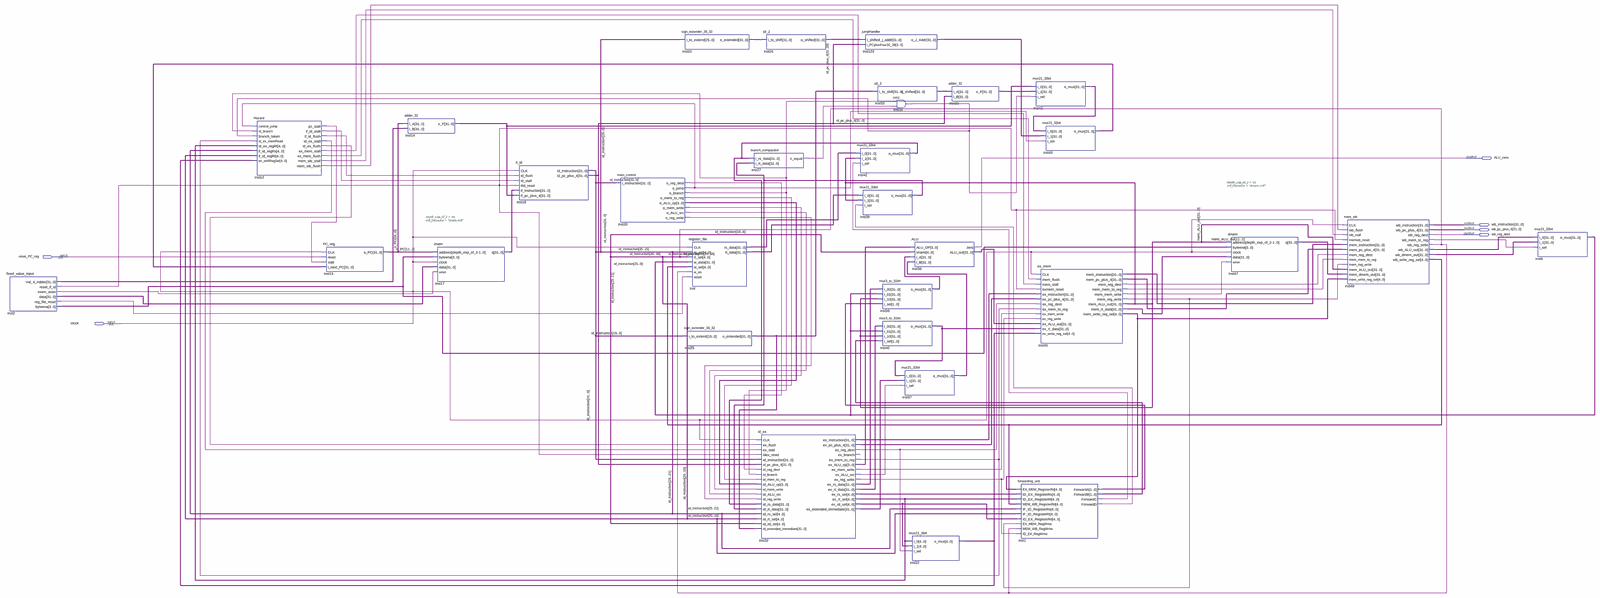
[diagram p0: schematic sheet, whole]
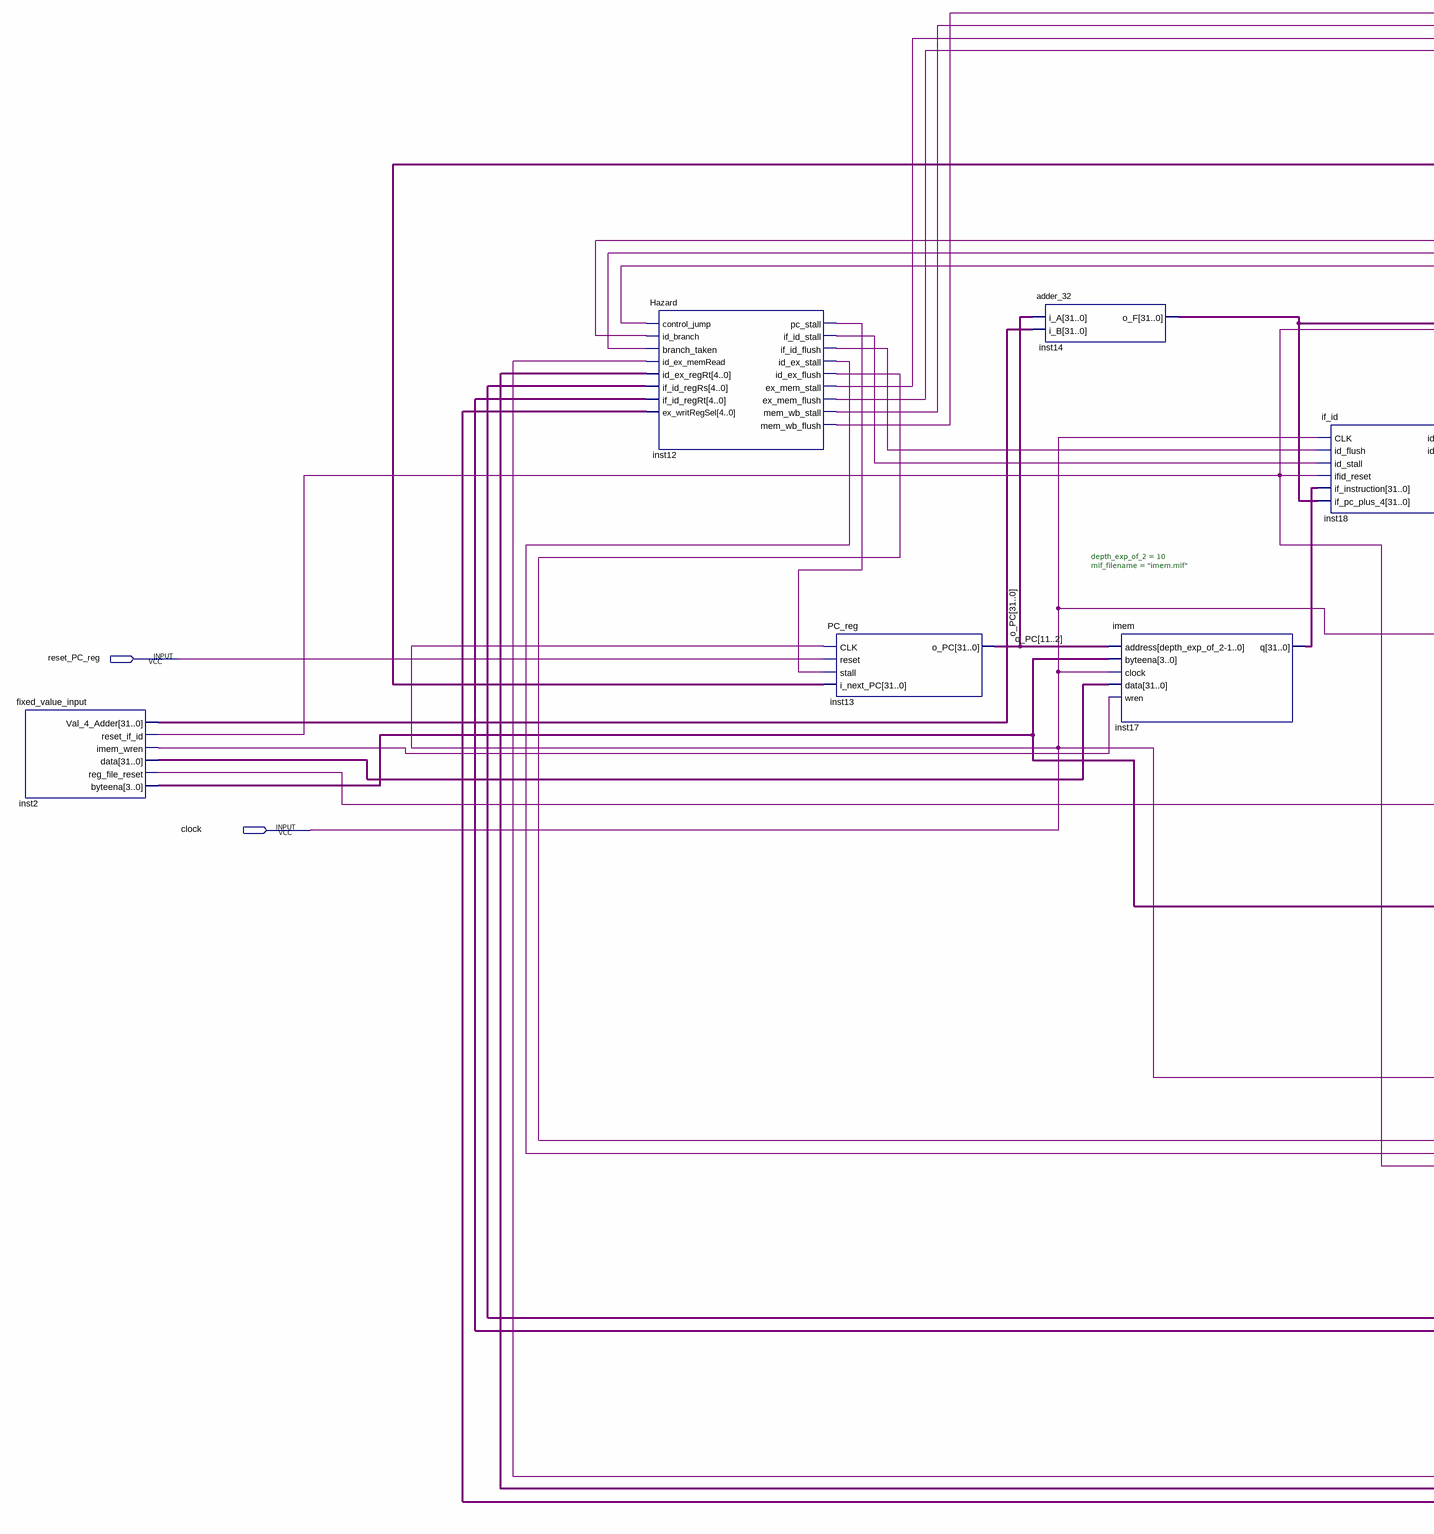
[diagram p1: schematic sheet, left part]
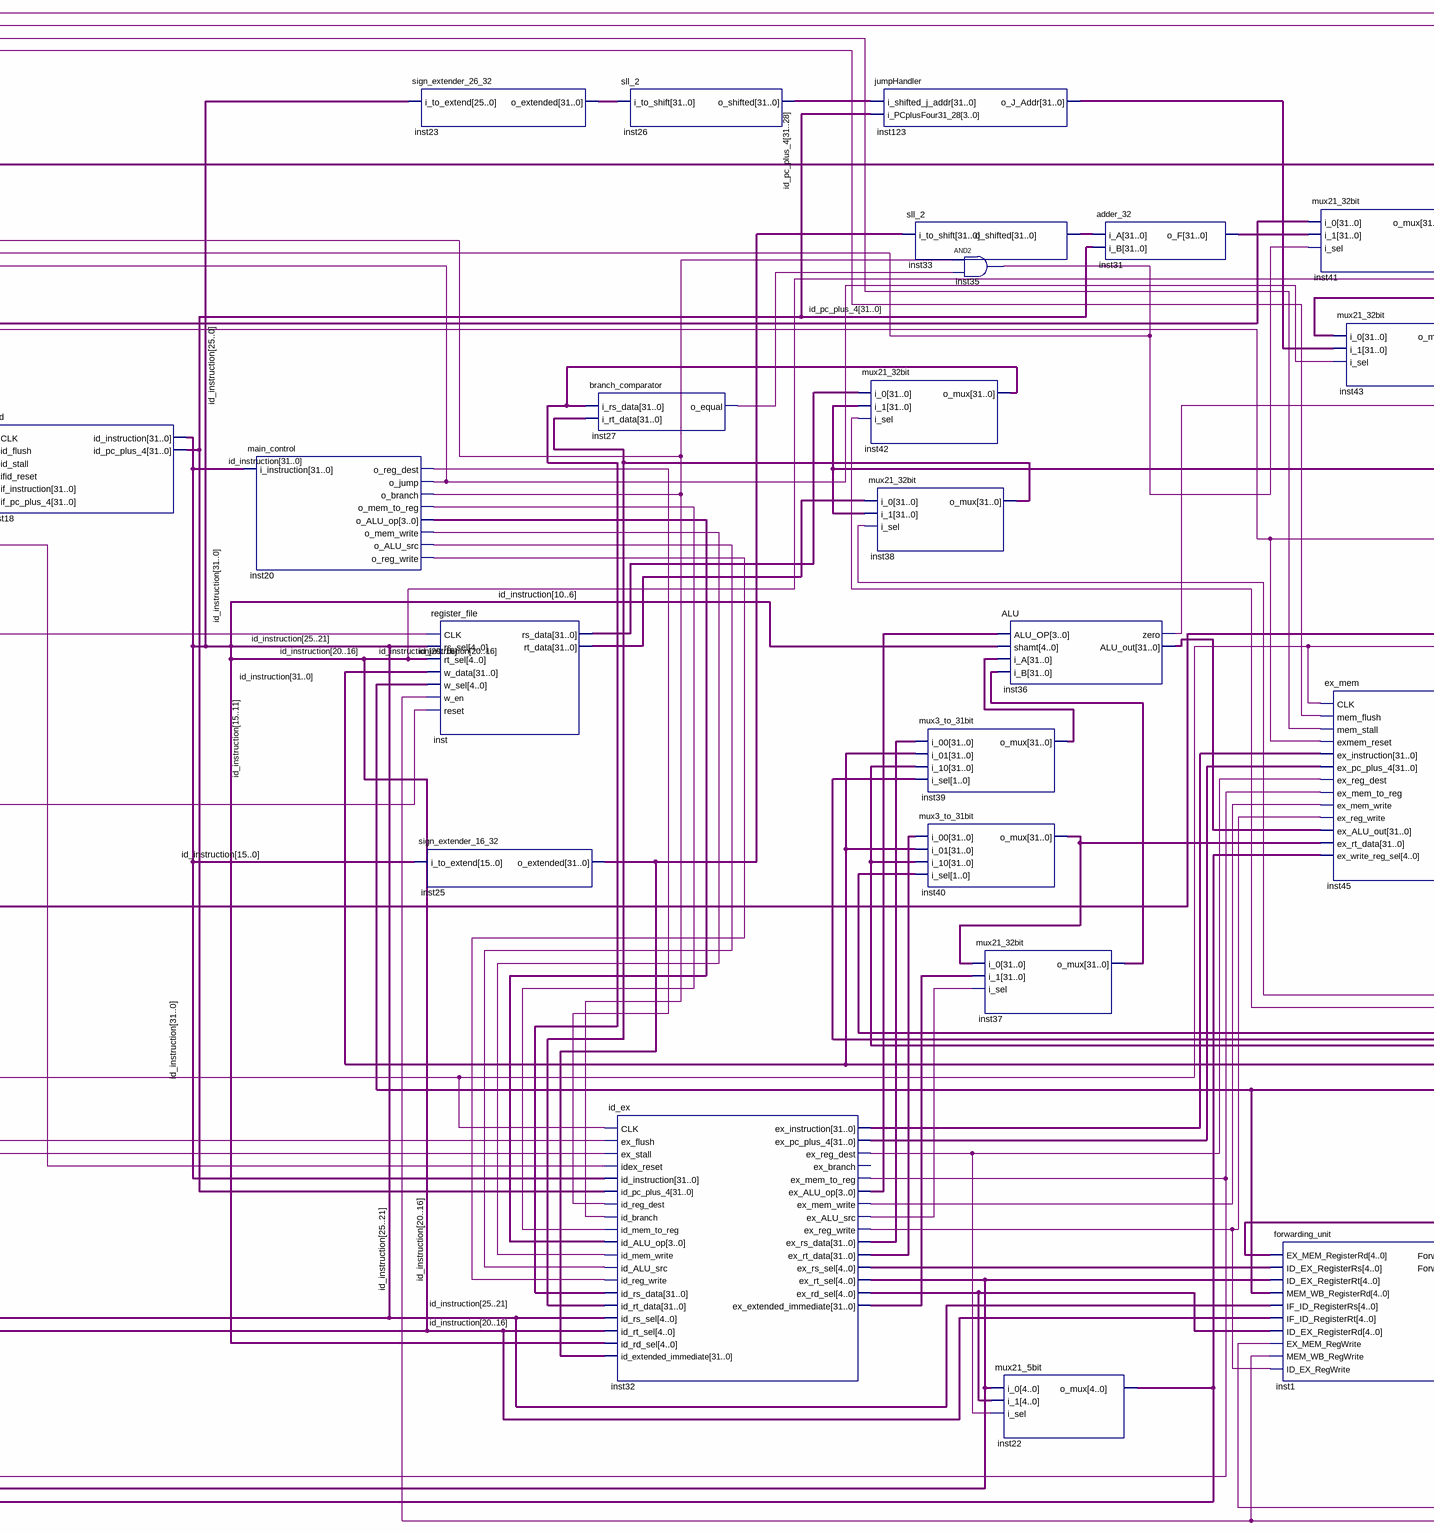
[diagram p2: schematic sheet, centre part]
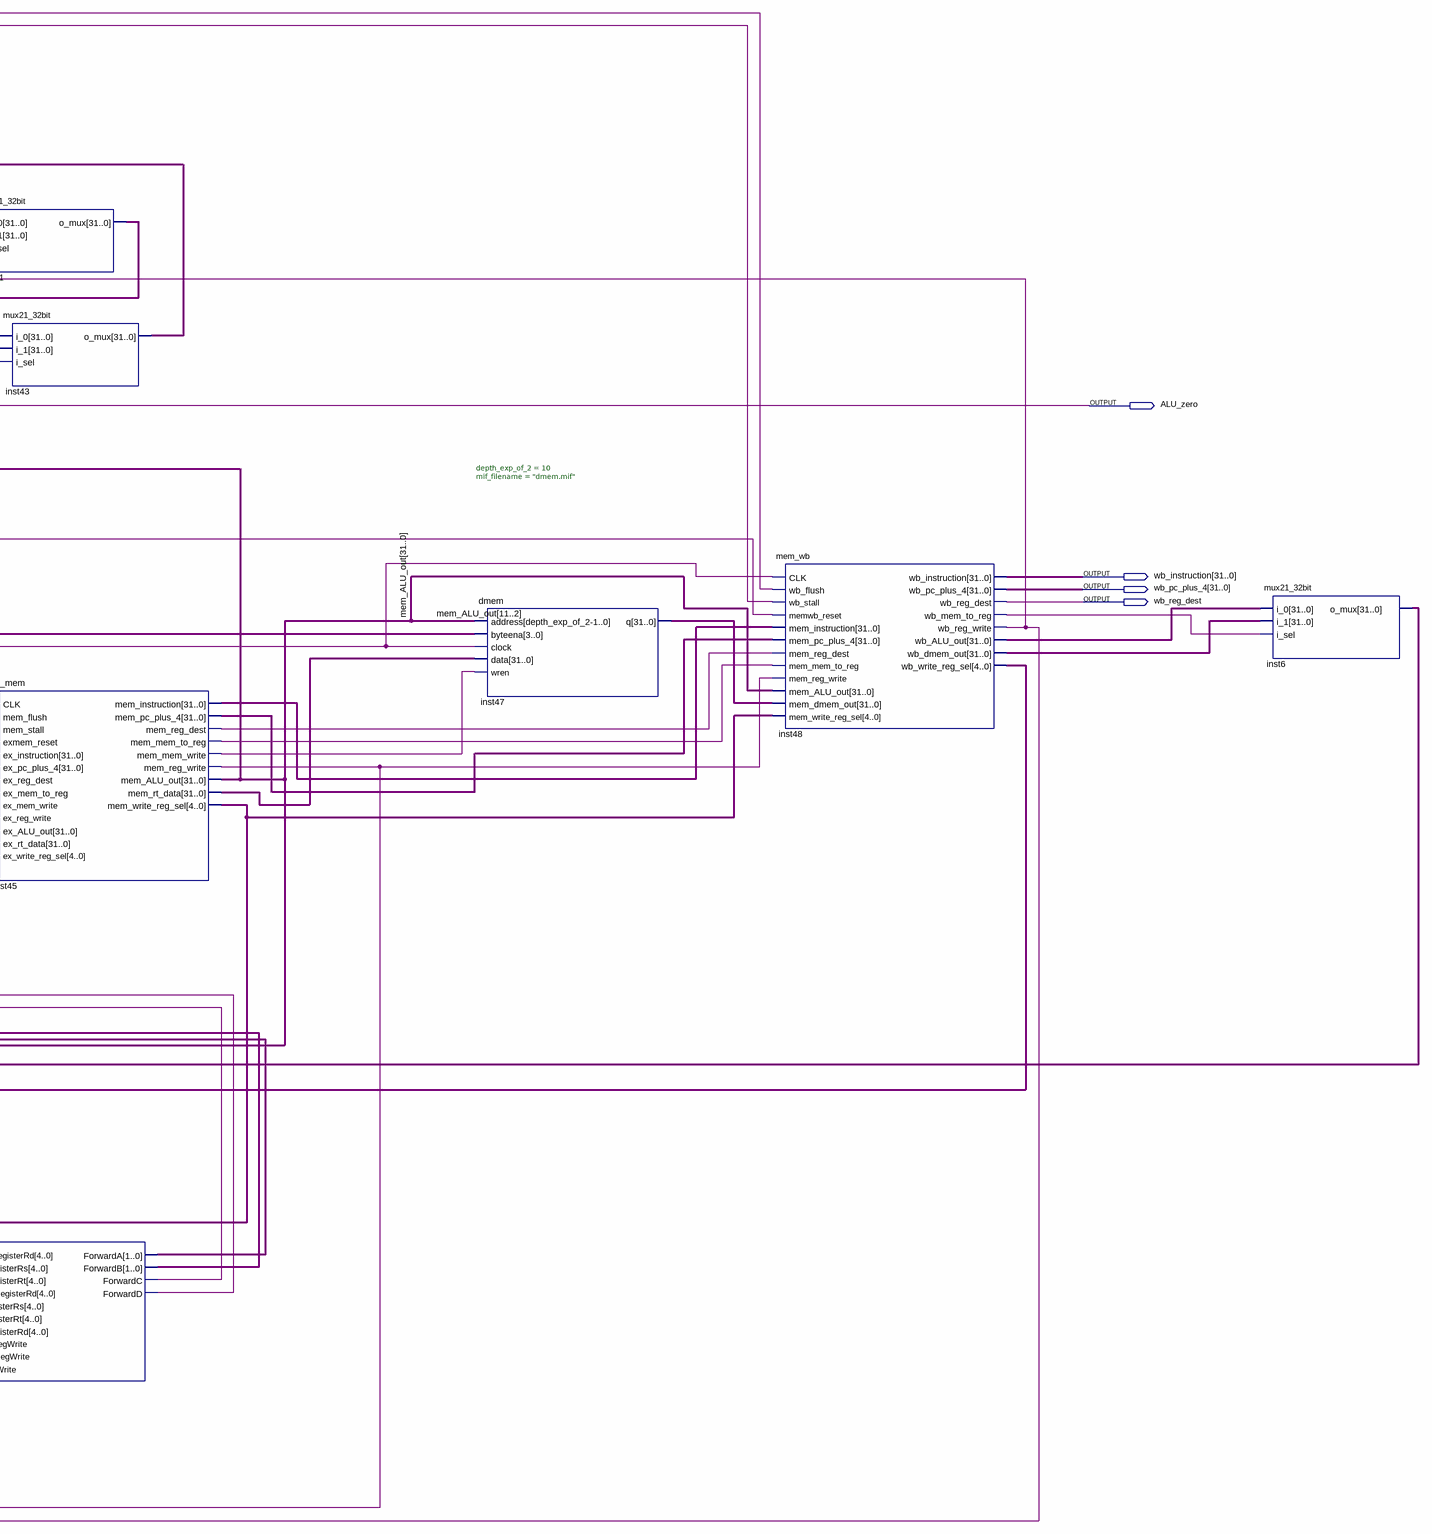
[diagram p3: schematic sheet, right part]
// Quartus schematic Pipeline_MIPS.bdf as structural Verilog: 31 symbols, 6 pins
module Pipeline_MIPS (
  input  reset_PC_reg,
  input  clock,
  output ALU_zero,
  output [31:0] wb_instruction,
  output [31:0] wb_pc_plus_4,
  output wb_reg_dest
);

  wire inst1_forwardc, inst1_forwardd, inst2_imem_wren, inst2_reg_file_reset, inst2_reset_if_id,
       inst12_ex_mem_flush, inst12_ex_mem_stall, inst12_id_ex_flush, inst12_id_ex_stall, inst12_if_id_flush,
       inst12_if_id_stall, inst12_mem_wb_flush, inst12_mem_wb_stall, inst12_pc_stall, inst20_o_alu_src,
       inst20_o_branch, inst20_o_jump, inst20_o_mem_to_reg, inst20_o_mem_write, inst20_o_reg_dest,
       inst20_o_reg_write, inst27_o_equal, inst32_ex_alu_src, inst32_ex_mem_to_reg, inst32_ex_mem_write,
       inst32_ex_reg_dest, inst32_ex_reg_write, inst35_out, inst45_mem_mem_to_reg, inst45_mem_mem_write,
       inst45_mem_reg_dest, inst45_mem_reg_write, inst48_wb_mem_to_reg, inst48_wb_reg_write;
  wire [1:0] inst1_forwarda, inst1_forwardb;
  wire [3:0] inst2_byteena, inst20_o_alu_op, inst32_ex_alu_op;
  wire [4:0] inst22_o_mux, inst32_ex_rd_sel, inst32_ex_rs_sel, inst32_ex_rt_sel, inst45_mem_write_reg_sel,
       inst48_wb_write_reg_sel;
  wire [31:0] id_instruction, id_pc_plus_4, inst2_data, inst2_val_4_adder, inst6_o_mux, inst14_o_f, inst17_q,
       inst23_o_extended, inst25_o_extended, inst26_o_shifted, inst31_o_f, inst32_ex_extended_immediate,
       inst32_ex_instruction, inst32_ex_pc_plus_4, inst32_ex_rs_data, inst32_ex_rt_data, inst33_o_shifted,
       inst36_alu_out, inst37_o_mux, inst38_o_mux, inst39_o_mux, inst40_o_mux, inst41_o_mux, inst42_o_mux,
       inst43_o_mux, inst45_mem_instruction, inst45_mem_pc_plus_4, inst45_mem_rt_data, inst47_q,
       inst48_wb_alu_out, inst48_wb_dmem_out, inst123_o_j_addr, inst_rs_data, inst_rt_data, mem_ALU_out, o_PC;

  fixed_value_input inst2 (
    .Val_4_Adder(inst2_val_4_adder), .reset_if_id(inst2_reset_if_id), .imem_wren(inst2_imem_wren),
    .data(inst2_data), .reg_file_reset(inst2_reg_file_reset), .byteena(inst2_byteena));
  Hazard inst12 (
    .control_jump(inst20_o_jump), .id_branch(inst20_o_branch), .branch_taken(inst35_out),
    .id_ex_memRead(inst32_ex_mem_to_reg), .id_ex_regRt(inst32_ex_rt_sel),
    .if_id_regRs(id_instruction[25:21]), .if_id_regRt(id_instruction[20:16]), .ex_writRegSel(inst22_o_mux),
    .pc_stall(inst12_pc_stall), .if_id_stall(inst12_if_id_stall), .if_id_flush(inst12_if_id_flush),
    .id_ex_stall(inst12_id_ex_stall), .id_ex_flush(inst12_id_ex_flush), .ex_mem_stall(inst12_ex_mem_stall),
    .ex_mem_flush(inst12_ex_mem_flush), .mem_wb_stall(inst12_mem_wb_stall), .mem_wb_flush(inst12_mem_wb_flush));
  PC_reg inst13 (.CLK(clock), .reset(reset_PC_reg), .stall(inst12_pc_stall), .i_next_PC(inst43_o_mux), .o_PC(o_PC));
  adder_32 inst14 (.i_A(o_PC), .i_B(inst2_val_4_adder), .o_F(inst14_o_f));
  imem #(.depth_exp_of_2(10), .mif_filename("imem.mif")) inst17 (
    .address(o_PC[11:2]), .byteena(inst2_byteena), .clock(clock), .data(inst2_data), .wren(inst2_imem_wren),
    .q(inst17_q));
  if_id inst18 (
    .CLK(clock), .id_flush(inst12_if_id_flush), .id_stall(inst12_if_id_stall),
    .ifid_reset(inst2_reset_if_id), .if_instruction(inst17_q), .if_pc_plus_4(inst14_o_f),
    .id_instruction(id_instruction), .id_pc_plus_4(id_pc_plus_4));
  main_control inst20 (
    .i_instruction(id_instruction), .o_reg_dest(inst20_o_reg_dest), .o_jump(inst20_o_jump),
    .o_branch(inst20_o_branch), .o_mem_to_reg(inst20_o_mem_to_reg), .o_ALU_op(inst20_o_alu_op),
    .o_mem_write(inst20_o_mem_write), .o_ALU_src(inst20_o_alu_src), .o_reg_write(inst20_o_reg_write));
  sign_extender_26_32 inst23 (.i_to_extend(id_instruction[25:0]), .o_extended(inst23_o_extended));
  register_file inst (
    .CLK(clock), .rs_sel(id_instruction[25:21]), .rt_sel(id_instruction[20:16]), .w_data(inst6_o_mux),
    .w_sel(inst48_wb_write_reg_sel), .w_en(inst48_wb_reg_write), .reset(inst2_reg_file_reset),
    .rs_data(inst_rs_data), .rt_data(inst_rt_data));
  sign_extender_16_32 inst25 (.i_to_extend(id_instruction[15:0]), .o_extended(inst25_o_extended));
  branch_comparator inst27 (.i_rs_data(inst42_o_mux), .i_rt_data(inst38_o_mux), .o_equal(inst27_o_equal));
  id_ex inst32 (
    .CLK(clock), .ex_flush(inst12_id_ex_flush), .ex_stall(inst12_id_ex_stall),
    .idex_reset(inst2_reset_if_id), .id_instruction(id_instruction), .id_pc_plus_4(id_pc_plus_4),
    .id_reg_dest(inst20_o_reg_dest), .id_branch(inst20_o_branch), .id_mem_to_reg(inst20_o_mem_to_reg),
    .id_ALU_op(inst20_o_alu_op), .id_mem_write(inst20_o_mem_write), .id_ALU_src(inst20_o_alu_src),
    .id_reg_write(inst20_o_reg_write), .id_rs_data(inst42_o_mux), .id_rt_data(inst38_o_mux),
    .id_rs_sel(id_instruction[25:21]), .id_rt_sel(id_instruction[20:16]), .id_rd_sel(id_instruction[15:11]),
    .id_extended_immediate(inst25_o_extended), .ex_instruction(inst32_ex_instruction),
    .ex_pc_plus_4(inst32_ex_pc_plus_4), .ex_reg_dest(inst32_ex_reg_dest),
    .ex_mem_to_reg(inst32_ex_mem_to_reg), .ex_ALU_op(inst32_ex_alu_op), .ex_mem_write(inst32_ex_mem_write),
    .ex_ALU_src(inst32_ex_alu_src), .ex_reg_write(inst32_ex_reg_write), .ex_rs_data(inst32_ex_rs_data),
    .ex_rt_data(inst32_ex_rt_data), .ex_rs_sel(inst32_ex_rs_sel), .ex_rt_sel(inst32_ex_rt_sel),
    .ex_rd_sel(inst32_ex_rd_sel), .ex_extended_immediate(inst32_ex_extended_immediate));  // open: ex_branch
  sll_2 inst26 (.i_to_shift(inst23_o_extended), .o_shifted(inst26_o_shifted));
  mux21_32bit inst42 (.i_0(inst_rs_data), .i_1(mem_ALU_out), .i_sel(inst1_forwardc), .o_mux(inst42_o_mux));
  mux21_32bit inst38 (.i_0(inst_rt_data), .i_1(mem_ALU_out), .i_sel(inst1_forwardd), .o_mux(inst38_o_mux));
  jumpHandler inst123 (
    .i_shifted_j_addr(inst26_o_shifted), .i_PCplusFour31_28(id_pc_plus_4[31:28]), .o_J_Addr(inst123_o_j_addr));
  sll_2 inst33 (.i_to_shift(inst25_o_extended), .o_shifted(inst33_o_shifted));
  mux3_to_31bit inst39 (
    .i_00(inst32_ex_rs_data), .i_01(inst6_o_mux), .i_10(mem_ALU_out), .i_sel(inst1_forwarda),
    .o_mux(inst39_o_mux));
  mux3_to_31bit inst40 (
    .i_00(inst32_ex_rt_data), .i_01(inst6_o_mux), .i_10(mem_ALU_out), .i_sel(inst1_forwardb),
    .o_mux(inst40_o_mux));
  and inst35 (inst35_out, inst20_o_branch, inst27_o_equal);
  ALU inst36 (
    .ALU_OP(inst32_ex_alu_op), .shamt(id_instruction[10:6]), .i_A(inst39_o_mux), .i_B(inst37_o_mux),
    .zero(ALU_zero), .ALU_out(inst36_alu_out));
  mux21_32bit inst37 (
    .i_0(inst40_o_mux), .i_1(inst32_ex_extended_immediate), .i_sel(inst32_ex_alu_src), .o_mux(inst37_o_mux));
  mux21_5bit inst22 (.i_0(inst32_ex_rt_sel), .i_1(inst32_ex_rd_sel), .i_sel(inst32_ex_reg_dest), .o_mux(inst22_o_mux));
  adder_32 inst31 (.i_A(inst33_o_shifted), .i_B(id_pc_plus_4), .o_F(inst31_o_f));
  forwarding_unit inst1 (
    .EX_MEM_RegisterRd(inst45_mem_write_reg_sel), .ID_EX_RegisterRs(inst32_ex_rs_sel),
    .ID_EX_RegisterRt(inst32_ex_rt_sel), .MEM_WB_RegisterRd(inst48_wb_write_reg_sel),
    .IF_ID_RegisterRs(id_instruction[25:21]), .IF_ID_RegisterRt(id_instruction[20:16]),
    .ID_EX_RegisterRd(inst32_ex_rd_sel), .EX_MEM_RegWrite(inst45_mem_reg_write),
    .MEM_WB_RegWrite(inst48_wb_reg_write), .ID_EX_RegWrite(inst32_ex_reg_write), .ForwardA(inst1_forwarda),
    .ForwardB(inst1_forwardb), .ForwardC(inst1_forwardc), .ForwardD(inst1_forwardd));
  mux21_32bit inst41 (.i_0(inst14_o_f), .i_1(inst31_o_f), .i_sel(inst35_out), .o_mux(inst41_o_mux));
  ex_mem inst45 (
    .CLK(clock), .mem_flush(inst12_ex_mem_flush), .mem_stall(inst12_ex_mem_stall),
    .exmem_reset(inst2_reset_if_id), .ex_instruction(inst32_ex_instruction),
    .ex_pc_plus_4(inst32_ex_pc_plus_4), .ex_reg_dest(inst32_ex_reg_dest),
    .ex_mem_to_reg(inst32_ex_mem_to_reg), .ex_mem_write(inst32_ex_mem_write),
    .ex_reg_write(inst32_ex_reg_write), .ex_ALU_out(inst36_alu_out), .ex_rt_data(inst40_o_mux),
    .ex_write_reg_sel(inst22_o_mux), .mem_instruction(inst45_mem_instruction),
    .mem_pc_plus_4(inst45_mem_pc_plus_4), .mem_reg_dest(inst45_mem_reg_dest),
    .mem_mem_to_reg(inst45_mem_mem_to_reg), .mem_mem_write(inst45_mem_mem_write),
    .mem_reg_write(inst45_mem_reg_write), .mem_ALU_out(mem_ALU_out), .mem_rt_data(inst45_mem_rt_data),
    .mem_write_reg_sel(inst45_mem_write_reg_sel));
  mux21_32bit inst43 (.i_0(inst41_o_mux), .i_1(inst123_o_j_addr), .i_sel(inst20_o_jump), .o_mux(inst43_o_mux));
  dmem #(.depth_exp_of_2(10), .mif_filename("dmem.mif")) inst47 (
    .address(mem_ALU_out[11:2]), .byteena(inst2_byteena), .clock(clock), .data(inst45_mem_rt_data),
    .wren(inst45_mem_mem_write), .q(inst47_q));
  mem_wb inst48 (
    .CLK(clock), .wb_flush(inst12_mem_wb_flush), .wb_stall(inst12_mem_wb_stall),
    .memwb_reset(inst2_reset_if_id), .mem_instruction(inst45_mem_instruction),
    .mem_pc_plus_4(inst45_mem_pc_plus_4), .mem_reg_dest(inst45_mem_reg_dest),
    .mem_mem_to_reg(inst45_mem_mem_to_reg), .mem_reg_write(inst45_mem_reg_write), .mem_ALU_out(mem_ALU_out),
    .mem_dmem_out(inst47_q), .mem_write_reg_sel(inst45_mem_write_reg_sel), .wb_instruction(wb_instruction),
    .wb_pc_plus_4(wb_pc_plus_4), .wb_reg_dest(wb_reg_dest), .wb_mem_to_reg(inst48_wb_mem_to_reg),
    .wb_reg_write(inst48_wb_reg_write), .wb_ALU_out(inst48_wb_alu_out), .wb_dmem_out(inst48_wb_dmem_out),
    .wb_write_reg_sel(inst48_wb_write_reg_sel));
  mux21_32bit inst6 (
    .i_0(inst48_wb_alu_out), .i_1(inst48_wb_dmem_out), .i_sel(inst48_wb_mem_to_reg), .o_mux(inst6_o_mux));
endmodule
